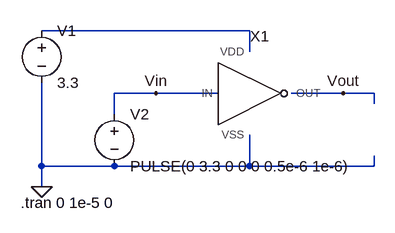
[diagram p0: schematic TB_inveter.asc]
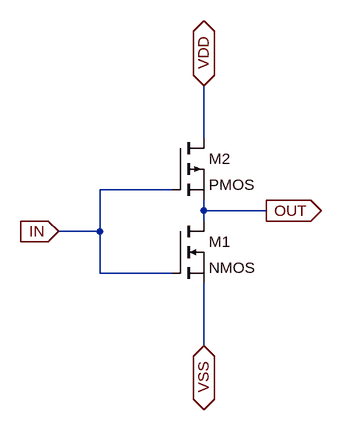
[diagram p1: sub-circuit inverter.asc]
TB_inveter.asc, the LTspice schematic file:
Version 4
SHEET 1 880 680
WIRE 208 80 -112 80
WIRE 208 112 208 80
WIRE 64 176 0 176
WIRE 160 176 64 176
WIRE 352 176 272 176
WIRE 400 176 352 176
WIRE 400 192 400 176
WIRE 0 208 0 176
WIRE -112 288 -112 160
WIRE 0 288 -112 288
WIRE 208 288 208 240
WIRE 208 288 0 288
WIRE 400 288 400 272
WIRE 400 288 208 288
WIRE -112 320 -112 288
FLAG -112 320 0
FLAG 64 176 Vin
FLAG 352 176 Vout
SYMBOL inverter 208 176 R0
SYMATTR InstName X1
SYMBOL voltage -112 64 R0
WINDOW 123 0 0 Left 0
WINDOW 39 0 0 Left 0
SYMATTR InstName V1
SYMATTR Value 3.3
SYMBOL voltage 0 192 R0
WINDOW 123 0 0 Left 0
WINDOW 39 0 0 Left 0
SYMATTR InstName V2
SYMATTR Value PULSE(0 3.3 0 0 0 0.5e-6 1e-6)
TEXT -144 344 Left 2 !.tran 0 1e-5 0

inverter.asc, the sub-circuit schematic file:
Version 4
SHEET 1 880 680
WIRE 240 16 240 -64
WIRE 192 96 80 96
WIRE 240 128 240 112
WIRE 336 128 240 128
WIRE 240 144 240 128
WIRE 80 160 80 96
WIRE 80 160 16 160
WIRE 80 224 80 160
WIRE 192 224 80 224
WIRE 240 336 240 240
FLAG 336 128 OUT
IOPIN 336 128 Out
FLAG 16 160 IN
IOPIN 16 160 In
FLAG 240 -64 VDD
IOPIN 240 -64 BiDir
FLAG 240 336 VSS
IOPIN 240 336 BiDir
SYMBOL nmos 192 144 R0
SYMATTR InstName M1
SYMBOL pmos 192 16 R0
SYMATTR InstName M2

The netlist it stands for:
* TB_inveter.asc
XX1 Vin Vout N001 0 inverter
V1 N001 0 3.3
V2 Vin 0 PULSE(0 3.3 0 0 0 0.5e-6 1e-6)

* block symbol definitions
.subckt inverter IN OUT VDD VSS
M1 OUT IN VSS VSS NMOS
M2 VDD IN OUT OUT PMOS
.ends inverter

.model NMOS NMOS
.model PMOS PMOS
.lib standard.mos
.tran 0 1e-5 0
.backanno
.end